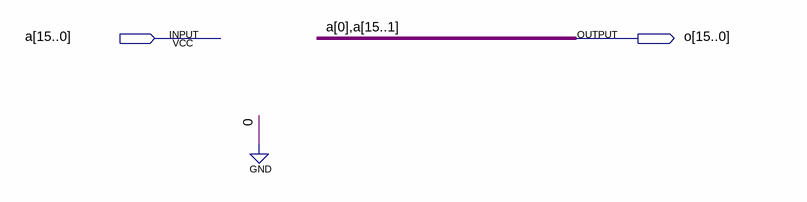
[diagram p0: schematic sheet]
// Quartus schematic AR_SR16.bdf as structural Verilog: 0 symbols, 2 pins
module AR_SR16 (
  input  [15:0] a,
  output [15:0] o
);


  assign o = {a[0], a[15:1]};
endmodule
